# Altium project B45100557C.PRJPCB
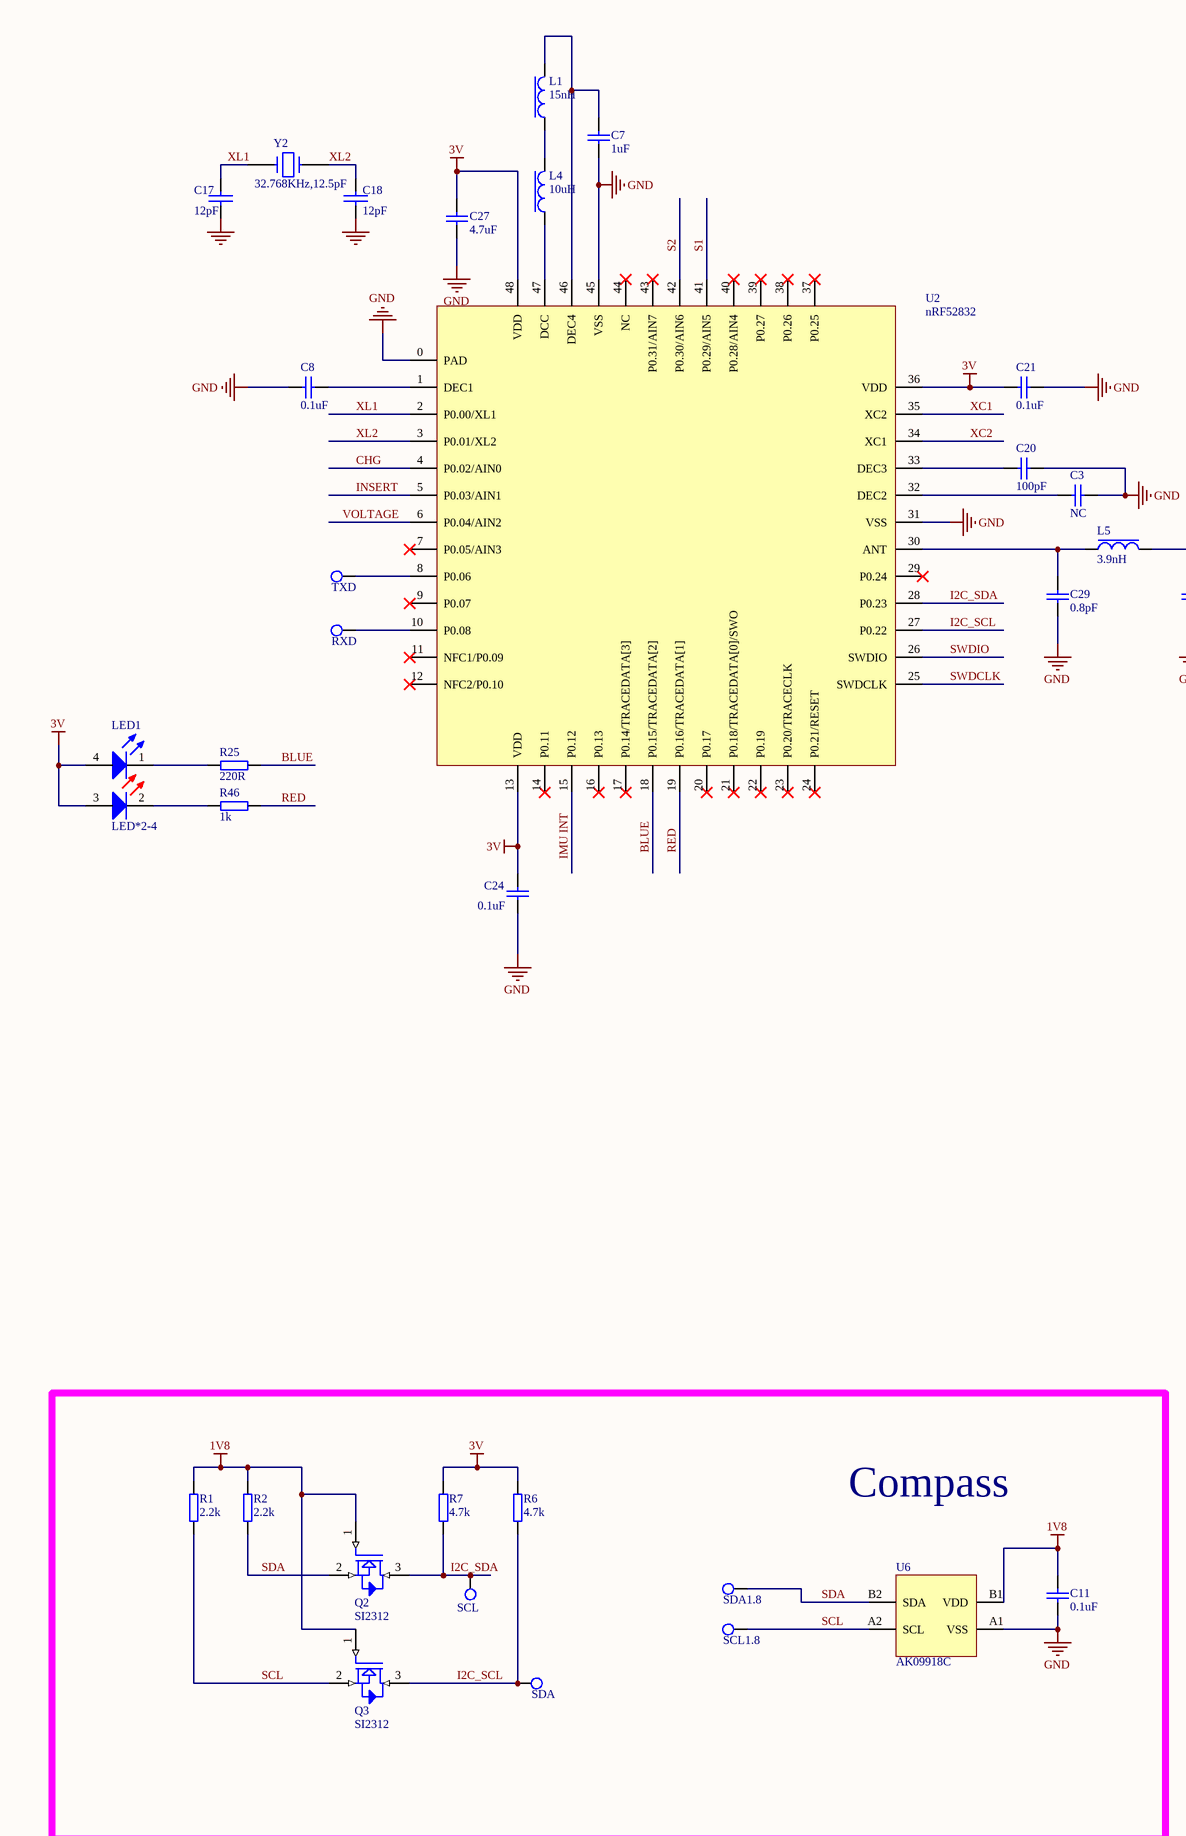
[diagram p0: B45100557C.SCHDOC, left]
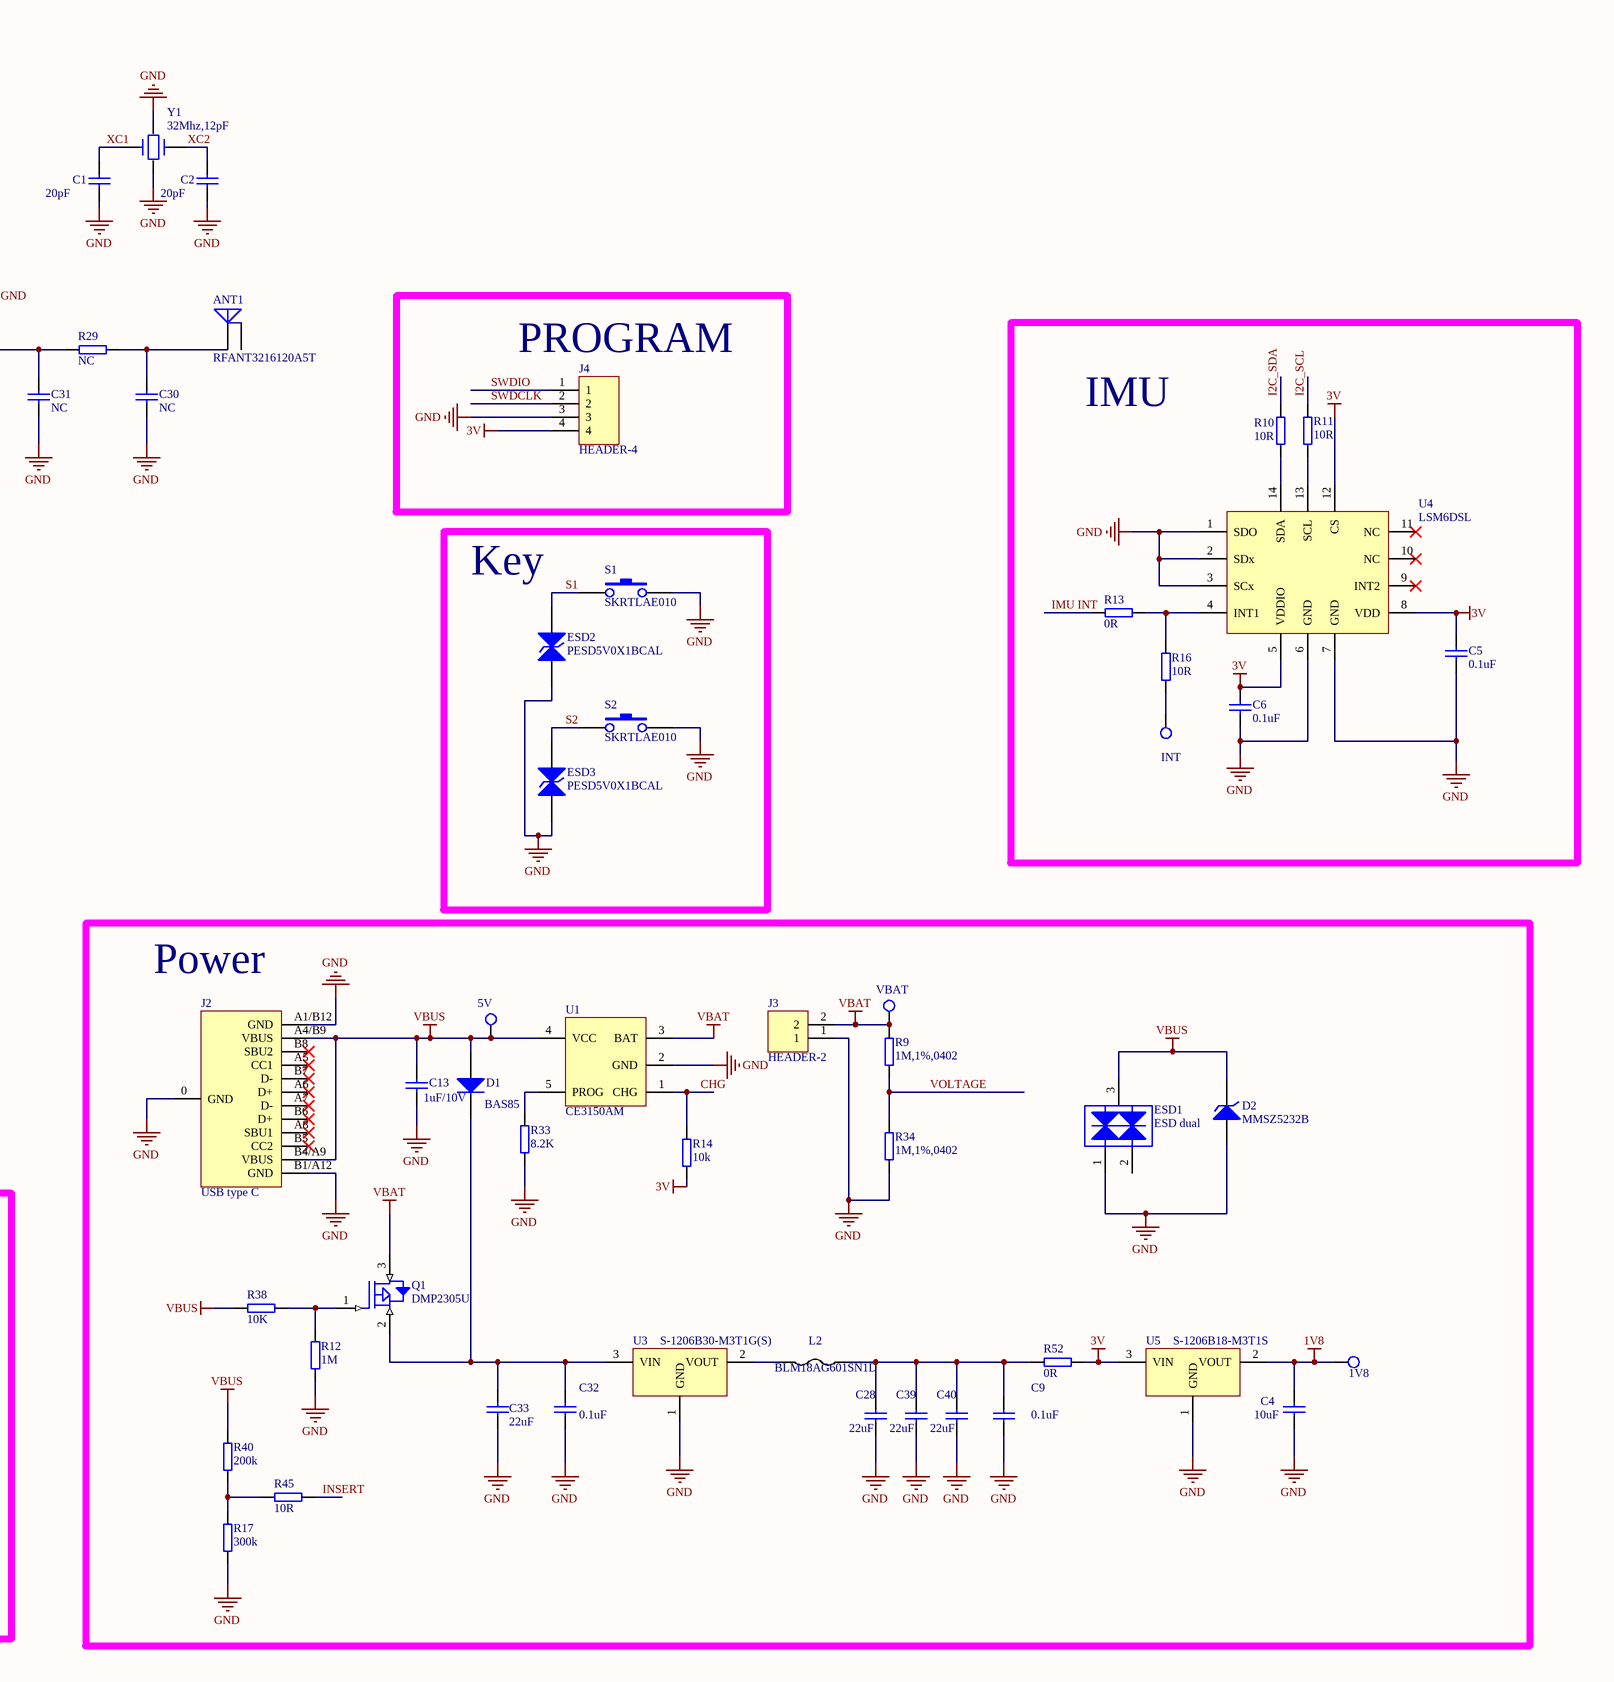
[diagram p1: B45100557C.SCHDOC, right]
1 sheet, 83 parts. Net scope: global (net labels, ports and power ports of the same name join across sheets).
Board file: B45100557C.PCBDOC

## Sheet B45100557C.SCHDOC
size A2

### Parts
1V8  TAP  [TS-1.0]  (value not drawn)
5V  TAP  [TS-1.0]  (value not drawn)
ANT1  RFANT3216120A5T  [RFANT3216120A1T]
C1  20pF  [C-0402]
C2  20pF  [C-0402]
C3  NC  [C-0402]
C4  10uF  [C-0603]
C5  0.1uF  [C-0402]
C6  0.1uF  [C-0402]
C7  1uF  [C-0402]
C8  0.1uF  [C-0402]
C9  0.1uF  [C-0402]
C11  0.1uF  [C-0402]
C13  1uF/10V  [C-0402]
C17  12pF  [C-0402]
C18  12pF  [C-0402]
C20  100pF  [C-0402]
C21  0.1uF  [C-0402]
C24  0.1uF  [C-0402]
C27  4.7uF  [C-0603]
C28  22uF  [C-0805]
C29  0.8pF  [C-0402]
C30  NC  [C-0402]
C31  NC  [C-0402]
C32  0.1uF  [C-0402]
C33  22uF  [C-0805]
C39  22uF  [C-0805]
C40  22uF  [C-0805]
D1  BAS85  [SOD-80]
D2  MMSZ5232B  [sod-123]
ESD1  ESD dual  [SOT-23]
ESD2  PESD5V0X1BCAL  [R-0402]
ESD3  PESD5V0X1BCAL  [R-0402]
INT  TAP  [TS-1.0]  (value not drawn)
J2  USB type C  [USB type C]
J3  HEADER-2  [1.25T-2AWB]
J4  HEADER-4  [PH-4-2.54-1]
L1  15nH  [R-0402]
L2  BLM18AG601SN1D  [R-0603]
L4  10uH  [R-0805]
L5  3.9nH  [R-0402]
LED1  LED*2-4  [A-SP1942R6B1C-A01-2T]
Q1  DMP2305U  [SOT-23]
Q2  SI2312  [SOT-23]
Q3  SI2312  [SOT-23]
R1  2.2k  [R-0402]
R2  2.2k  [R-0402]
R6  4.7k  [R-0402]
R7  4.7k  [R-0402]
R9  1M,1%,0402  [R-0402]
R10  10R  [R-0402]
R11  10R  [R-0402]
R12  1M  [R-0402]
R13  0R  [R-0402]
R14  10k  [R-0402]
R16  10R  [R-0402]
R17  300k  [R-0402]
R25  220R  [R-0402]
R29  NC  [R-0402]
R33  8.2K  [R-0402]
R34  1M,1%,0402  [R-0402]
R38  10K  [R-0402]
R40  200k  [R-0402]
R45  10R  [R-0402]
R46  1k  [R-0402]
R52  0R  [R-0603]
RXD  TAP  [TS-1.0]  (value not drawn)
S1  SKRTLAE010  [SKRTLAE010]
S2  SKRTLAE010  [SKRTLAE010]
SCL  TAP  [TS-1.0]  (value not drawn)
SCL1.8  TAP  [TS-1.0]  (value not drawn)
SDA  TAP  [TS-1.0]  (value not drawn)
SDA1.8  TAP  [TS-1.0]  (value not drawn)
TXD  TAP  [TS-1.0]  (value not drawn)
U1  CE3150AM  [SOT-23-5]
U2  nRF52832  [QFN-48-6*6-0.4]
U3  S-1206B30-M3T1G(S)  [SOT-23]
U4  LSM6DSL  [LGA14]
U5  S-1206B18-M3T1S  [SOT-23]
U6  AK09918C  [AK09918C]
VBAT  TAP  [TS-1.0]  (value not drawn)
Y1  32Mhz,12pF  [XD3225-1-12M-125M]
Y2  32.768KHz,12.5pF  [32.768Khz-3215]

### Blocks framed on the sheet
PROGRAM: J4
IMU: C5 C6 INT R10 R11 R13 R16 U4
Key: ESD2 ESD3 S1 S2
Power: 1V8 5V C4 C9 C13 C28 C32 C33 C39 C40 D1 D2 ESD1 J2 J3 L2 Q1 R9 R12 R14 R17 R33 R34 R38 R40 R45 R52 U1 U3 U5 VBAT
Compass: C11 Q2 Q3 R1 R2 R6 R7 SCL SCL1.8 SDA SDA1.8 U6

### Nets
1V8: 1V8.1 C4.1 C11.1 Q2.1(G) Q3.1(G) R1.1 R2.1 U5.2(VOUT) U6.B1(VDD)
3V: C5.1 C6.1 C21.1 C24.1 C27.1 J4.4 LED1.3 LED1.4 R6.1 R7.1 R14.1 R52.1 U2.13(VDD) U2.36(VDD) U2.48(VDD) U4.5(VDDIO) U4.8(VDD) U4.12(CS) U5.3(VIN)
GND: C1.2 C2.2 C3.2 C4.2 C5.2 C6.2 C7.1 C8.1 C9.2 C11.2 C13.2 C17.2 C18.2 C20.2 C21.2 C24.2 C27.2 C28.2 C29.2 C30.2 C31.2 C32.2 C33.2 C39.2 C40.2 D2.1 ESD1.1 ESD2.1 ESD3.1 J2.0(GND) J2.A1/B12(GND) J2.B1/A12(GND) J3.1 J4.3 R12.1 R17.1 R33.1 R34.1 S1.1 S2.1 U1.2(GND) U2.0(PAD) U2.31(VSS) U2.45(VSS) U3.1(GND) U4.1(SDO) U4.2(SDx) U4.3(SCx) U4.6(GND) U4.7(GND) U5.1(GND) U6.A1(VSS) Y1.3
VBAT: J3.2 Q1.3(D) R9.2 U1.3(BAT) VBAT.1
VBUS: 5V.1 C13.1 D1.1 D2.2 ESD1.3 J2.A4/B9(VBUS) J2.B4/A9(VBUS) R38.2 R40.2 U1.4(VCC)
BLUE: R25.1 U2.18(P0.15/TRACEDATA[2])
CHG: R14.2 U1.1(CHG) U2.4(P0.02/AIN0)
I2C_SCL: Q3.3(D) R6.2 R11.2 SDA.1 U2.27(P0.22)
I2C_SDA: Q2.3(D) R7.2 R10.2 SCL.1 U2.28(P0.23)
IMU INT: R13.1 U2.15(P0.12)
INSERT: R45.1 U2.5(P0.03/AIN1)
RED: R46.1 U2.19(P0.16/TRACEDATA[1])
S1: ESD2.2 S1.2 U2.41(P0.29/AIN5)
S2: ESD3.2 S2.2 U2.42(P0.30/AIN6)
SCL: Q3.2(S) R1.2 SCL1.8.1 U6.A2(SCL)
SDA: Q2.2(S) R2.2 SDA1.8.1 U6.B2(SDA)
SWDCLK: J4.2 U2.25(SWDCLK)
SWDIO: J4.1 U2.26(SWDIO)
VOLTAGE: R9.1 R34.2 U2.6(P0.04/AIN2)
XC1: C1.1 U2.35(XC2) Y1.1
XC2: C2.1 U2.34(XC1) Y1.2
XL1: C17.1 U2.2(P0.00/XL1) Y2.1
XL2: C18.1 U2.3(P0.01/XL2) Y2.2
NetANT1_1: ANT1.1 C30.1 R29.2
NetC3_1: C3.1 U2.32(DEC2)
NetC7_2: C7.2 L1.2 U2.46(DEC4)
NetC8_2: C8.2 U2.1(DEC1)
NetC9_1: C9.1 C28.1 C39.1 C40.1 L2.1 R52.2
NetC20_1: C20.1 U2.33(DEC3)
NetC29_1: C29.1 L5.1 U2.30(ANT)
NetC31_1: C31.1 L5.2 R29.1
NetC32_1: C32.1 C33.1 D1.2 Q1.2(S) U3.3(VIN)
NetINT_1: INT.1 R16.1
NetL1_1: L1.1 L4.2
NetL2_2: L2.2 U3.2(VOUT)
NetL4_1: L4.1 U2.47(DCC)
NetLED1_1: LED1.1 R25.2
NetLED1_2: LED1.2 R46.2
NetQ1_1: Q1.1(G) R12.2 R38.1
NetR10_1: R10.1 U4.14(SDA)
NetR11_1: R11.1 U4.13(SCL)
NetR13_2: R13.2 R16.2 U4.4(INT1)
NetR17_2: R17.2 R40.1 R45.2
NetR33_2: R33.2 U1.5(PROG)
NetRXD_1: RXD.1 U2.10(P0.08)
NetTXD_1: TXD.1 U2.8(P0.06)

Not connected (* = marked no-connect by the designer): ANT1 2; ESD1 2; J2 A5(CC1)* A6(D+)* A7(D-)* A8(SBU1)* B5(CC2)* B6(D+)* B7(D-)* B8(SBU2)*; U2 7(P0.05/AIN3)* 9(P0.07)* 11(NFC1/P0.09)* 12(NFC2/P0.10)* 14(P0.11)* 16(P0.13)* 17(P0.14/TRACEDATA[3])* 20(P0.17)* 21(P0.18/TRACEDATA[0]/SWO)* 22(P0.19)* 23(P0.20/TRACECLK)* 24(P0.21/RESET)* 29(P0.24)* 37(P0.25)* 38(P0.26)* 39(P0.27)* 40(P0.28/AIN4)* 43(P0.31/AIN7)* 44(NC)*; U4 9(INT2)* 10(NC)* 11(NC)*

### Library data of the parts
ANT1 = ANTENNA
C1-C3 C7 C8 C20 C21 C24 C27 C29-C31 = CAP: 9NC: 4.5.2.000980
C4 C9 C13 C28 C32 C33 C39 C40 = CAP
C5 C6 C11 = Cap: capacitor 27 pF NPO , +/- 2 %, SMD case 0603; Manufacturer: Generic Components; Class: Passive; Value: 27pF; Published: 08/06/2000; Publisher: Altium Hobart Technology Centre; SubClass: Capacitor
C17 C18 = CAP: Capacitor
D1 = DIODE
D2 = ZENER
ESD2 ESD3 = ESD
L1 L4 L5 = INDUCTOR
L2 = Inductance
Q1 = MOSFET P
Q2 Q3 = MOSFET N
R1 R2 R6 R7 R9-R14 R16 R17 R25 R29 R33 R34 R38 R40 R45 R46 R52 = RES
S1 S2 = SW-PB
U3 U5 = S-1206BXX
Y1 = CRYSTAL4
Y2 = CRYSTAL2